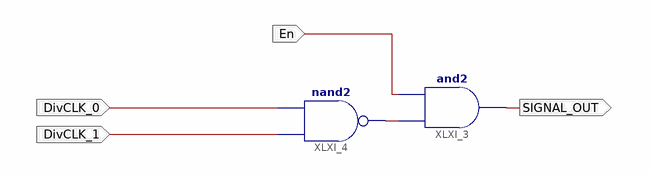
[diagram p0: schematic sheet 1]
// Xilinx ISE schematic BOOBOO_EN.sch (spartan3e) as structural Verilog: 2 symbols, 4 ports
module BOOBOO_EN (
  input  DivCLK_0,
  input  DivCLK_1,
  input  En,
  output SIGNAL_OUT
);

  wire XLXN_5;

  and XLXI_3 (SIGNAL_OUT, XLXN_5, En);
  nand XLXI_4 (XLXN_5, DivCLK_1, DivCLK_0);
endmodule
